# EAGLE design gametroller (EAGLE 9.2.0)
AUTHOR: w. boyett; CONTACT_ADDRESS: github.com/watsonboyett; CONTACT_COMPANY: Make Time Club; CONTACT_PHONE: Licensed under CC-BY-SA; REV: 1B
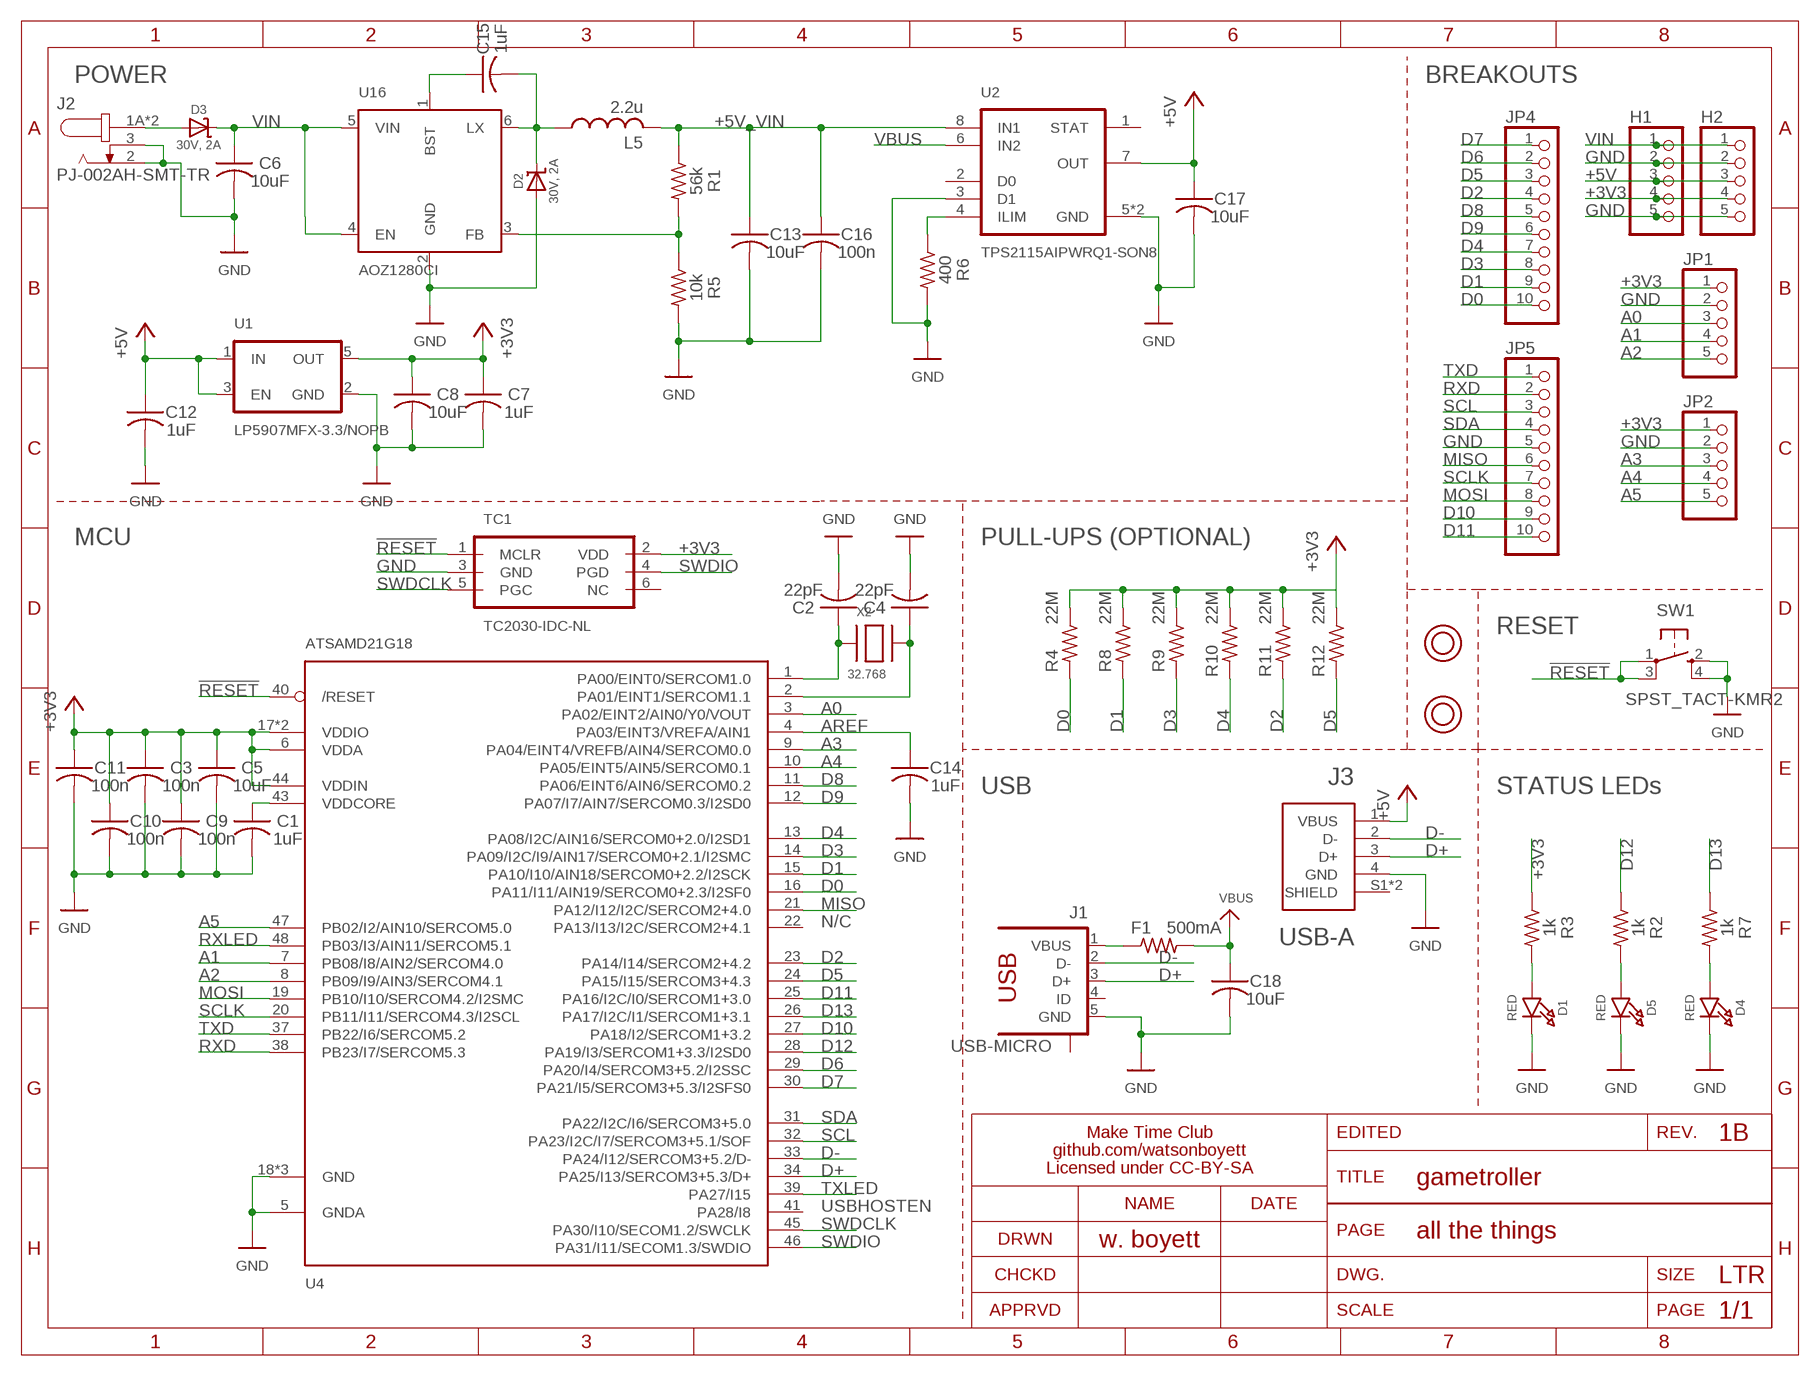
[diagram p0: schematic, sheet 1]
FRAME2 (LETTER_L): SECTION: all the things

## Parts
C1  1uF  C-USC0603  [C0603]
C2  22pF  C-USC0603  [C0603]
C3  100n  C-USC0603  [C0603]
C4  22pF  C-USC0603  [C0603]
C5  10uF  C-USC0805  [C0805]
C6  10uF  C-USC0805  [C0805]
C7  1uF  C-USC0603  [C0603]
C8  10uF  C-USC0805  [C0805]
C9  100n  C-USC0603  [C0603]
C10  100n  C-USC0603  [C0603]
C11  100n  C-USC0603  [C0603]
C12  1uF  C-USC0603  [C0603]
C13  10uF  C-USC0805  [C0805]
C14  1uF  C-USC0603  [C0603]
C15  1uF  C-USC0603  [C0603]
C16  100n  C-USC0603  [C0603]
C17  10uF  C-USC0805  [C0805]
C18  10uF  C-USC0805  [C0805]
D1  RED  LED0805_NOOUTLINE  [CHIPLED_0805_NOOUTLINE]
D2  30V, 2A  DIODE-SCHOTTKYSOD-128  [SOD-128]
D3  30V, 2A  DIODE-SCHOTTKYSOD-128  [SOD-128]
D4  RED  LED0805_NOOUTLINE  [CHIPLED_0805_NOOUTLINE]
D5  RED  LED0805_NOOUTLINE  [CHIPLED_0805_NOOUTLINE]
F1  500mA  R-US_R0603  [R0603]
H1  PINHD-1X5-SMT  [1X05-SMT]
H2  PINHD-1X5-SMT  [1X05-SMT]
J1  USB-MICRO  [USB-10118192-0001LF]
J2  PJ-002AH-SMT-TR  [CUI_PJ-002AH-SMT-TR]
J3  USB-A  [CUI_UJ2-AH-1-SMT]
JP1  PINHD-1X5-SMT  [1X05-SMT]
JP2  PINHD-1X5-SMT  [1X05-SMT]
JP4  PINHD-1X10-SMT  [1X10-SMT]
JP5  PINHD-1X10-SMT  [1X10-SMT]
L5  2.2u  L-USL5050M  [L5050M]
R1  56k  R-US_R0603  [R0603]
R2  1k  R-US_R0603  [R0603]
R3  1k  R-US_R0603  [R0603]
R4  22M  R-US_R0603  [R0603]
R5  10k  R-US_R0603  [R0603]
R6  400  R-US_R0603  [R0603]
R7  1k  R-US_R0603  [R0603]
R8  22M  R-US_R0603  [R0603]
R9  22M  R-US_R0603  [R0603]
R10  22M  R-US_R0603  [R0603]
R11  22M  R-US_R0603  [R0603]
R12  22M  R-US_R0603  [R0603]
SW1  SPST_TACT-KMR2  [KMR2]
TC1  TC2030-IDC-NL  [TC2030-IDC-NL]
U1  LP5907MFX-3.3/NOPB  [SOT95P280X145-5N]
U2  TPS2115AIPWRQ1-SON8  [SON65P300X300X100-9N]
U4  ATSAMD21G18  ATSAMD21J_QFP  [TQFP48_7MM]
U16  AOZ1280CI  [SOT-23-6]
U$7  TERM-7774  [TERM-7774]
U$9  TERM-7774  [TERM-7774]
X2  32.768  XTAL-3.2X1.5  [XTAL3215]

## Nets
!RESET: SW1.1(P) SW1.3(P1) TC1.1(MCLR) U4.40(/RESET)
+3V3: C3.1 C5.1 C7.1 C8.1 C9.1 C10.1 C11.1 H1.4 H2.4 JP1.1 JP2.1 R3.1 R4.1 R8.1 R9.1 R10.1 R11.1 R12.1 TC1.2(VDD) U1.5(OUT) U4.6(VDDA) U4.17(VDDIO) U4.36(VDDIO) U4.44(VDDIN)
+5V: C12.1 C17.1 H1.3 H2.3 J3.1(VBUS) U1.1(IN) U1.3(EN) U2.7(OUT)
+5V_VIN: C13.1 C16.1 L5.2 R1.1 U2.8(IN1)
A0: JP1.3 U4.3(PA02/EINT2/AIN0/Y0/VOUT)
A1: JP1.4 U4.7(PB08/I8/AIN2/SERCOM4.0)
A2: JP1.5 U4.8(PB09/I9/AIN3/SERCOM4.1)
A3: JP2.3 U4.9(PA04/EINT4/VREFB/AIN4/SERCOM0.0)
A4: JP2.4 U4.10(PA05/EINT5/AIN5/SERCOM0.1)
A5: JP2.5 U4.47(PB02/I2/AIN10/SERCOM5.0)
AREF: C14.1 U4.4(PA03/EINT3/VREFA/AIN1)
D0: JP4.10 R4.2 U4.16(PA11/I11/AIN19/SERCOM0+2.3/I2SF0)
D1: JP4.9 R8.2 U4.15(PA10/I10/AIN18/SERCOM0+2.2/I2SCK)
D2: JP4.4 R11.2 U4.23(PA14/I14/SERCOM2+4.2)
D3: JP4.8 R9.2 U4.14(PA09/I2C/I9/AIN17/SERCOM0+2.1/I2SMC)
D4: JP4.7 R10.2 U4.13(PA08/I2C/AIN16/SERCOM0+2.0/I2SD1)
D5: JP4.3 R12.2 U4.24(PA15/I15/SERCOM3+4.3)
D6: JP4.2 U4.29(PA20/I4/SERCOM3+5.2/I2SSC)
D7: JP4.1 U4.30(PA21/I5/SERCOM3+5.3/I2SFS0)
D8: JP4.5 U4.11(PA06/EINT6/AIN6/SERCOM0.2)
D9: JP4.6 U4.12(PA07/I7/AIN7/SERCOM0.3/I2SD0)
D10: JP5.9 U4.27(PA18/I2/SERCOM1+3.2)
D11: JP5.10 U4.25(PA16/I2C/I0/SERCOM1+3.0)
D12: R2.1 U4.28(PA19/I3/SERCOM1+3.3/I2SD0)
D13: R7.1 U4.26(PA17/I2C/I1/SERCOM1+3.1)
D+: J1.3(D+) J3.3(D+) U4.34(PA25/I13/SERCOM3+5.3/D+)
D-: J1.2(D-) J3.2(D-) U4.33(PA24/I12/SERCOM3+5.2/D-)
GND: C1.2 C2.2 C3.2 C4.2 C5.2 C6.2 C7.2 C8.2 C9.2 C10.2 C11.2 C12.2 C13.2 C14.2 C16.2 C17.2 C18.2 D1.C D2.A D4.C D5.C H1.2 H1.5 H2.2 H2.5 J1.5(GND) J2.2 J2.3 J3.4(GND) JP1.2 JP2.2 JP5.5 R5.2 R6.2 SW1.2(S) SW1.4(S1) TC1.3(GND) U1.2(GND) U2.3(D1) U2.5(GND) U2.9(GND) U4.5(GNDA) U4.18(GND) U4.35(GND) U4.42(GND) U16.2(GND)
LX: C15.2 D2.C L5.1 U16.6(LX)
MISO: JP5.6 U4.21(PA12/I12/I2C/SERCOM2+4.0)
MOSI: JP5.8 U4.19(PB10/I10/SERCOM4.2/I2SMC)
N$1: D5.A R2.2
N$2: D4.A R7.2
N$3: D1.A R3.2
N$4: F1.1 J1.1(VBUS)
N$5: C2.1 U4.1(PA00/EINT0/SERCOM1.0) X2.P$1
N$7: C4.1 U4.2(PA01/EINT1/SERCOM1.1) X2.P$2
N$8: C15.1 U16.1(BST)
N$9: R6.1 U2.4(ILIM)
N$11: R1.2 R5.1 U16.3(FB)
RXD: JP5.2 U4.38(PB23/I7/SERCOM5.3)
RXLED: U4.48(PB03/I3/AIN11/SERCOM5.1)
SCL: JP5.3 U4.32(PA23/I2C/I7/SERCOM3+5.1/SOF)
SCLK: JP5.7 U4.20(PB11/I11/SERCOM4.3/I2SCL)
SDA: JP5.4 U4.31(PA22/I2C/I6/SERCOM3+5.0)
SWDCLK: TC1.5(PGC) U4.45(PA30/I10/SECOM1.2/SWCLK)
SWDIO: TC1.4(PGD) U4.46(PA31/I11/SECOM1.3/SWDIO)
TXD: JP5.1 U4.37(PB22/I6/SERCOM5.2)
TXLED: U4.39(PA27/I15)
VBUS: C18.1 F1.2 U2.6(IN2)
VDDCORE: C1.1 U4.43(VDDCORE)
VIN: C6.1 D3.C H1.1 H2.1 U16.4(EN) U16.5(VIN)
VIN_PRE: D3.A J2.1A J2.1B
Unconnected: J1.4(ID) J1.M1(S) J1.M2(S) J1.S1(S) J1.S2(S) J1.S3(S) J1.S4(S) J3.S1(SHIELD) J3.S2(SHIELD) TC1.6(NC) U2.1(STAT) U2.2(D0) U4.22(PA13/I13/I2C/SERCOM2+4.1) U4.41(PA28/I8)

## Notes on the sheet
- POWER | BREAKOUTS
- MCU | PULL-UPS (OPTIONAL)
- RESET
- USB | STATUS LEDs
- N/C
- USBHOSTEN

## Library data of the parts
C1 C7 C12 C14 C15 = gametroller:C-US: CAPACITOR, American symbol; MFG: AVX Corporation; MPN: 0603ZC105KAT2A; PN-DK: 478-7940-1-ND
C2 C4 = gametroller:C-US: CAPACITOR, American symbol; MFG: KEMET; MPN: C0603C220K4GACTU; PN-DK: 399-9031-1-ND
C3 C9-C11 C16 = gametroller:C-US: CAPACITOR, American symbol; MFG: KEMET; MPN: C0603X104K5RAC7867; PN-DK: 399-7969-1-ND
C5 C6 C8 C13 C17 C18 = gametroller:C-US: CAPACITOR, American symbol; MFG: TDK Corporation; MPN: C2012JB1E106K085AC; PN-DK: 445-11462-1-ND
D1 D4 D5 = gametroller:LED: LED 0603 - 0603 Surface Mount Package 2mA: Green LED - Low Power (3.9mcd, 2ma, 1.7Vf) - Digikey: 475-2709-2-ND Orange LED - Low Power (9.8mcd, 2ma, 1.8Vf) - Digikey: 475-1194-2-ND Red LED - Low Power (5mcd, 2ma, 1.8Vf) - Digikey: 475-1195-2-ND Yellow LED - Low Power (7mcd, 2ma, 1.8Vf) - Digikey: 475-1196-2-ND 5mA: Blue LED - Low Power (17mcd, 5ma, 2.9Vf) - Digikey: LNJ937W8CRACT-ND 0805 - 0805 Surface Mount Package 2mA: Red LED (8.8mcd, 2mA, 1.8Vf, Clear) - Low Power [Digikey: 475-2510-1-ND] Green LED (5mcd, 2mA, 1.8Vf, Clear) - Low Power [Digikey: 475-2730-1-ND] Yellow LED (11.3mcd, 2mA, 1.8Vf, Clear) - Low Power [Digikey: 475-2555-1-ND] 20mA: Red LED (104mcd, 20mA, Diffused) - LS R976 [Digikey: 475-1278-6-ND] Red LED (12mcd, 20mA, 2.0Vf, Clear) - APT2012EC [Digikey: 754-1128-1-ND] Green LED (15mcd, 20mA, 2.2Vf, Clear) - APT2012GC [Digikey: 754-1131-1-ND] Orange LED (160mcd, 20mA, 2.1Vf, Clear) - APT2012SECK [Digikey: 754-1130-1-ND] 1206 - 1206 Surface Mount Package Green LED (26mcd, 20mA, Diffused) - LG N971 [Digikey: 475-1407-6-ND] Red LED (15mcd, 20mA, Diffused) - LH N974 [Digikey: 475-1416-6-ND] Cree - Cree High-Power Surface Mount LEDs XPEBWT-L1-0000-00D50 - White 111lm 350mA 2.9Vf 6200K 110° XTEAWT-00-0000-00000LEE3 - White 114lm 350mA 2.85Vf 5000K 115° Everlight - Everlight 45-21 Series Surface Mount LEDs 45-21/QK2C-B2832AC2CB2/2T - Warm White 2000mcd 20mA 3.25Vf 3050K 120° 45-21/LK2C-B38452C4CB2/2T - Nuetral White 2000mcd 20mA 3.25Vf 4150K 120° 45-21/LK2C-B50634C6CB2/2T - Cold White 2200mcd 20mA 3.25Vf 5650K 120° PLCC2 Reverse Mount LS T77K-J1L2-1-0-2-R18-Z - Red 11.25mcd 2mA 1.8Vf 630nm 120° LO T77K-L1M2-24-Z - Orange 19.6mcd 2mA 1.8Vf 606nm 120° LY T77K-K2M1-26-Z - Yellow 15.7mcd 2mA 1.8Vf 587nm 120°; MFG: Lite-On Inc.; MPN: LTST-C170GKT; PN-DK: 160-1179-1-ND
D2 D3 = gametroller:DIODE-SCHOTTKY; MFG: Toshiba Semiconductor and Storage; MPN: CMS06(TE12L,Q,M); PN-DK: CMS06QMCT-ND
F1 = gametroller:R-US_: RESISTOR, American symbol; MFG: Bourns Inc.; MPN: MF-FSMF050X-2; PN-DK: MF-FSMF050X-2CT-ND
H1 H2 JP1 JP2 = gametroller:PINHD-1X5: PIN HEADER
J1 = gametroller:USB-MICRO: CONN USB MICRO B RECPT SMT R/A; MFG: Amphenol; MPN: 10118192-0001LF; PN-DK: 609-4613-1-ND
J2 = gametroller:PJ-002AH-SMT-TR: Power Barrel Connector Jack 2.00mm ID (0.079"), 5.50mm OD (0.217"); MFG: CUI; MPN: PJ-002AH-SMT-TR; PN-DK: CP-002AHPJCT-ND
J3 = gametroller:USB-A: USB - A USB 2.0 Receptacle Connector; MFG: CUI; MPN: UJ2-AH-1-SMT-TR; PN-DK: 102-4133-1-ND
JP4 JP5 = gametroller:PINHD-1X10: PIN HEADER
L5 = gametroller:L-US: INDUCTOR, American symbol; MFG: Laird-Signal Integrity Products; MPN: TYS50402R2N-10; PN-DK: 240-2714-1-ND
R1 = gametroller:R-US_: RESISTOR, American symbol; MFG: Panasonic Electronic Components; MPN: ERJ-3EKF5602V; PN-DK: P56.0KHCT-ND
R2 R3 R7 = gametroller:R-US_: RESISTOR, American symbol; MFG: Panasonic Electronic Components; MPN: ERJ-3EKF1001V; PN-DK: P1.00KHCT-ND
R4 R8-R12 = gametroller:R-US_: RESISTOR, American symbol; MFG: Panasonic Electronic Components; MPN: ERJ-3GEYK226V; PN-DK: P22MGCT-ND
R5 = gametroller:R-US_: RESISTOR, American symbol; MFG: Panasonic Electronic Components; MPN: ERJ-3GEYJ103V; PN-DK: P10KGCT-ND
R6 = gametroller:R-US_: RESISTOR, American symbol; MFG: Panasonic Electronic Components; MPN: ERJ-3EKF4020V; PN-DK: P402HCT-ND
SW1 = gametroller:SPST_TACT: SMT 6mm switch, EVQQ2 series http://www.ladyada.net/library/eagle; MFG: C&K; MPN: KMR211GLFS; PN-DK: 401-1426-1-ND
TC1 = gametroller:TC2030-IDC: Tag-Connect In Circuit Programming & Debug Cable 6 Pin http://www.tag-connect.com; MFG: Tag-Connect; MPN: TC2030-IDC
U1 = gametroller:LP5907MFX-3.3/NOPB: IC REG LINEAR 3.3V 250MA SOT23; MFG: Texas Instruments; MPN: LP5907MFX-3.3/NOPB; PN-DK: 296-38557-1-ND
U2 = gametroller:TPS2115AIPWRQ1: AUTO-SWITCHING POWER MULTIPLEXER; MFG: Texas Instruments; MPN: TPS2115ADRBR; PN-DK: 296-23394-1-ND
U4 = gametroller:ATSAMD21J: ARM® Cortex®-M0+ SAM D21G Microcontroller IC 32-Bit 48MHz 256KB (256K x 8) FLASH; MFG: Microchip Technology; MPN: ATSAMD21G18A; PN-DK: ATSAMD21G18A-AFTCT-ND
U16 = gametroller:AOZ1280CI: IC REG BUCK ADJ 1.2A SOT23-6; MFG: Alpha & Omega Semiconductor Inc.; MPN: AOZ1280CI; PN-DK: 785-1277-1-ND
U$7 U$9 = gametroller:TERM: TERM SCREW 4-40 4 PIN PCB RA; MFG: Keystone Electronics; MPN: 7774; PN-DK: 36-7774-ND
X2 = gametroller:XTAL: Low cost SMT crystals, no capacitors included http://www.ladyada.net/library/eagle; MFG: ECS Inc.; MPN: ECS-.327-12.5-34B-TR; PN-DK: XC1617CT-ND

## Board
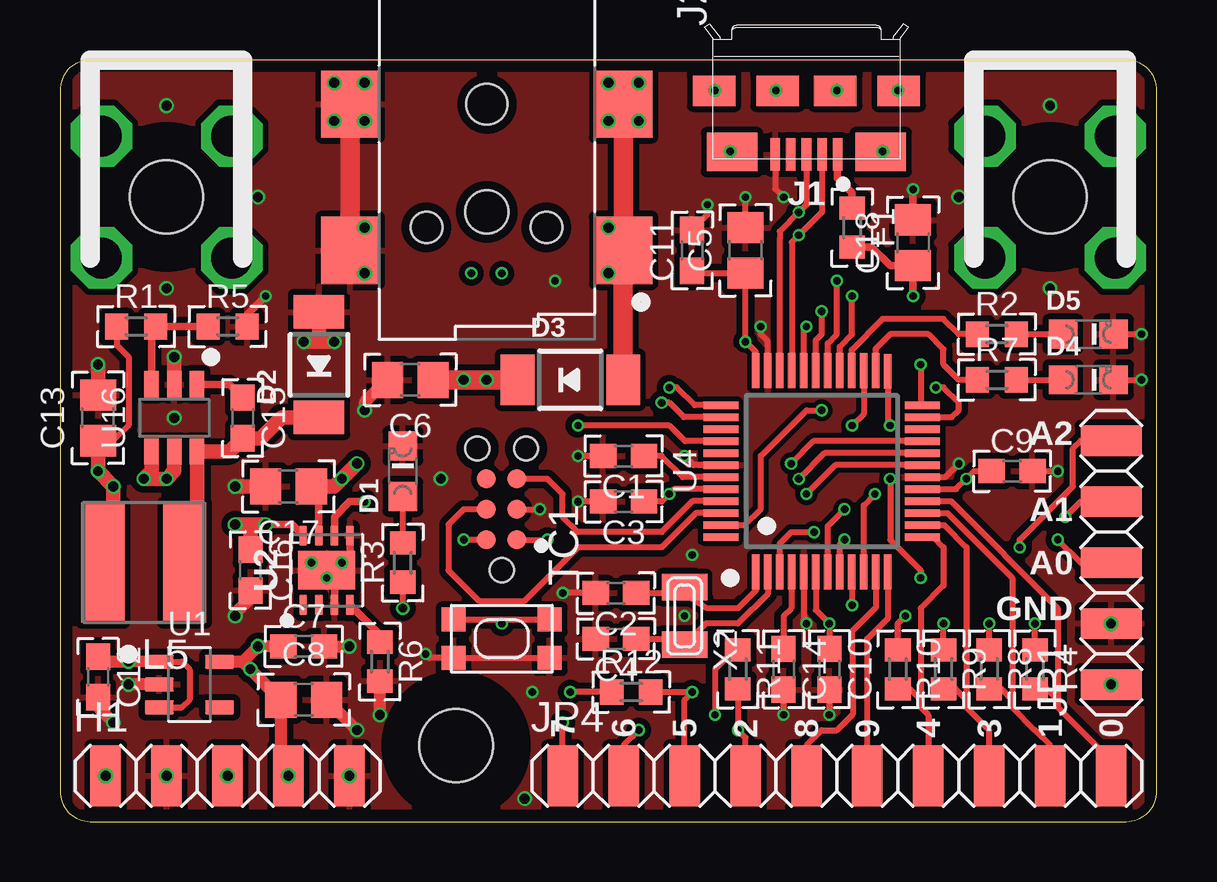
[diagram p1: board, top side]
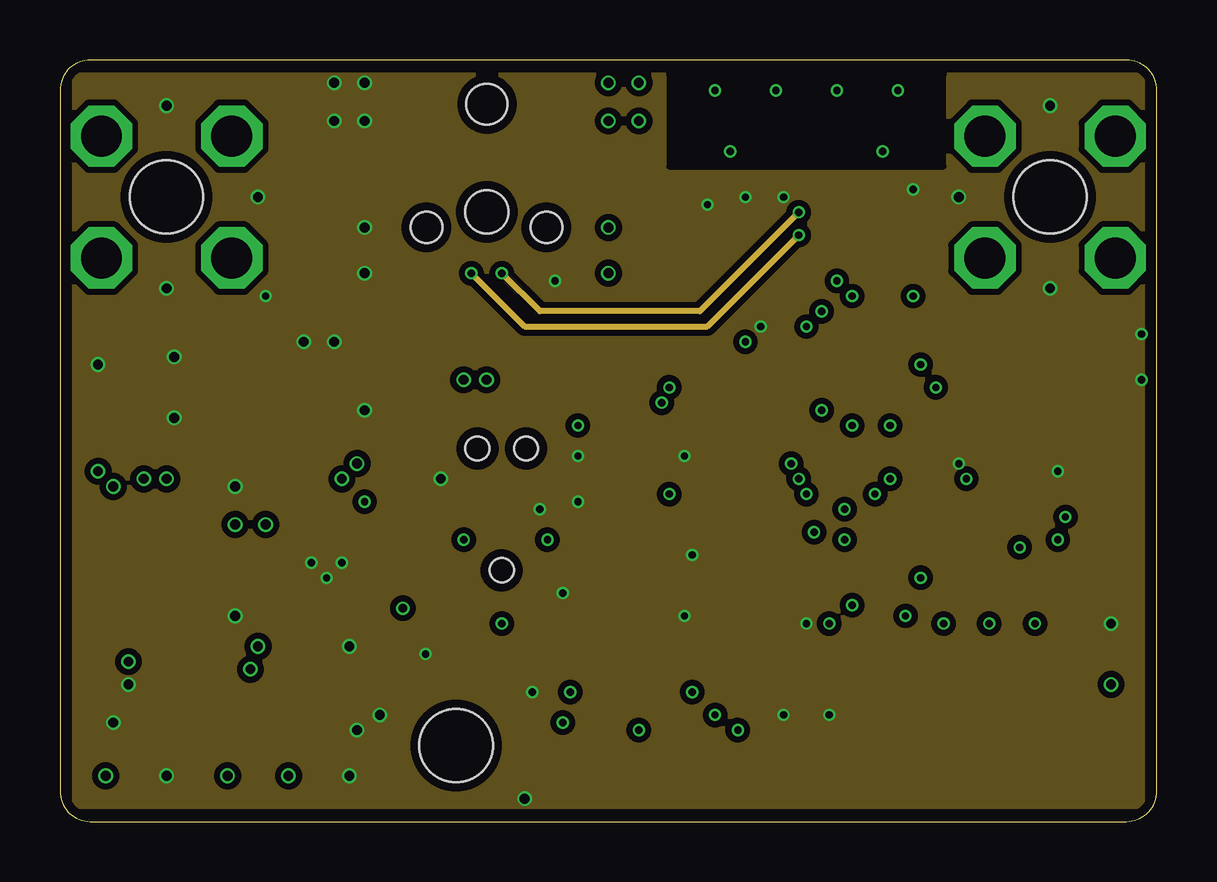
[diagram p2: board, inner layer Route2]
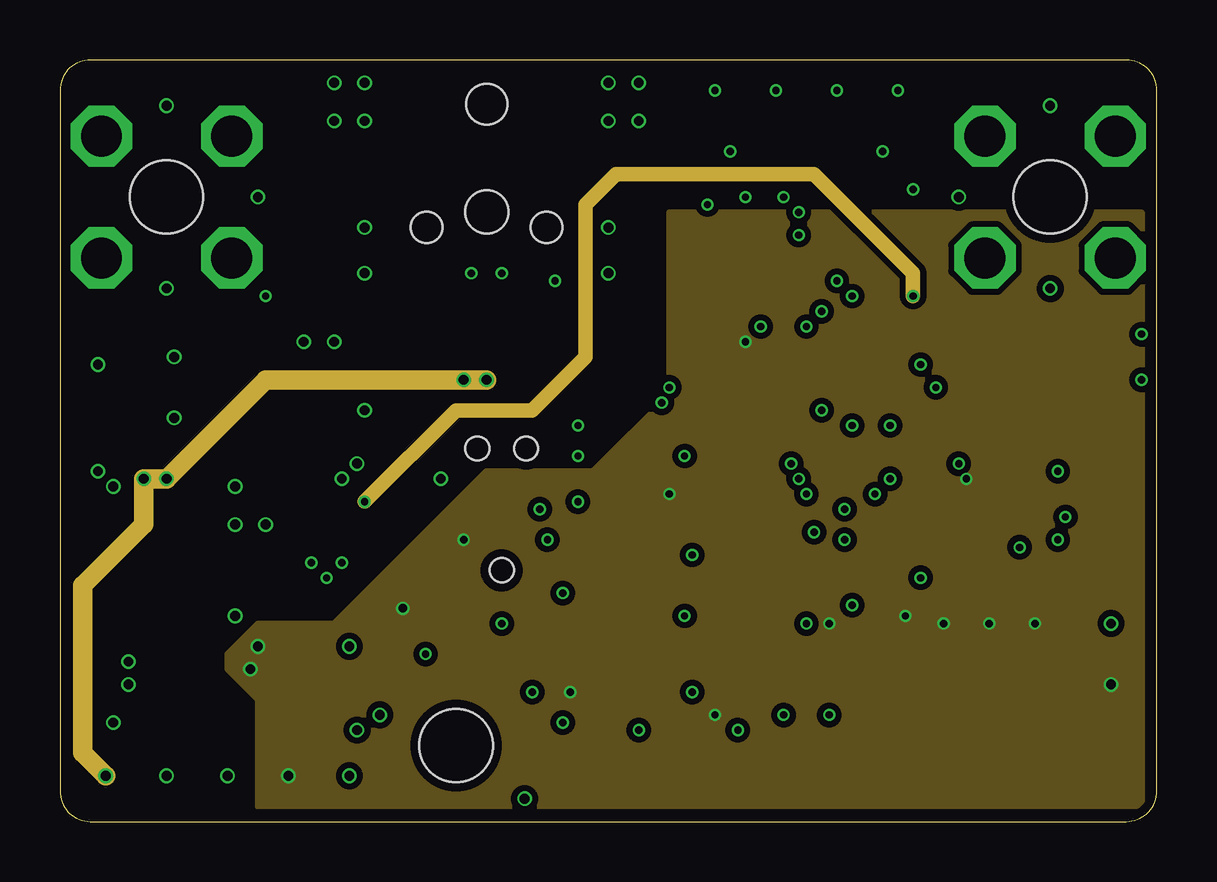
[diagram p3: board, inner layer Route15]
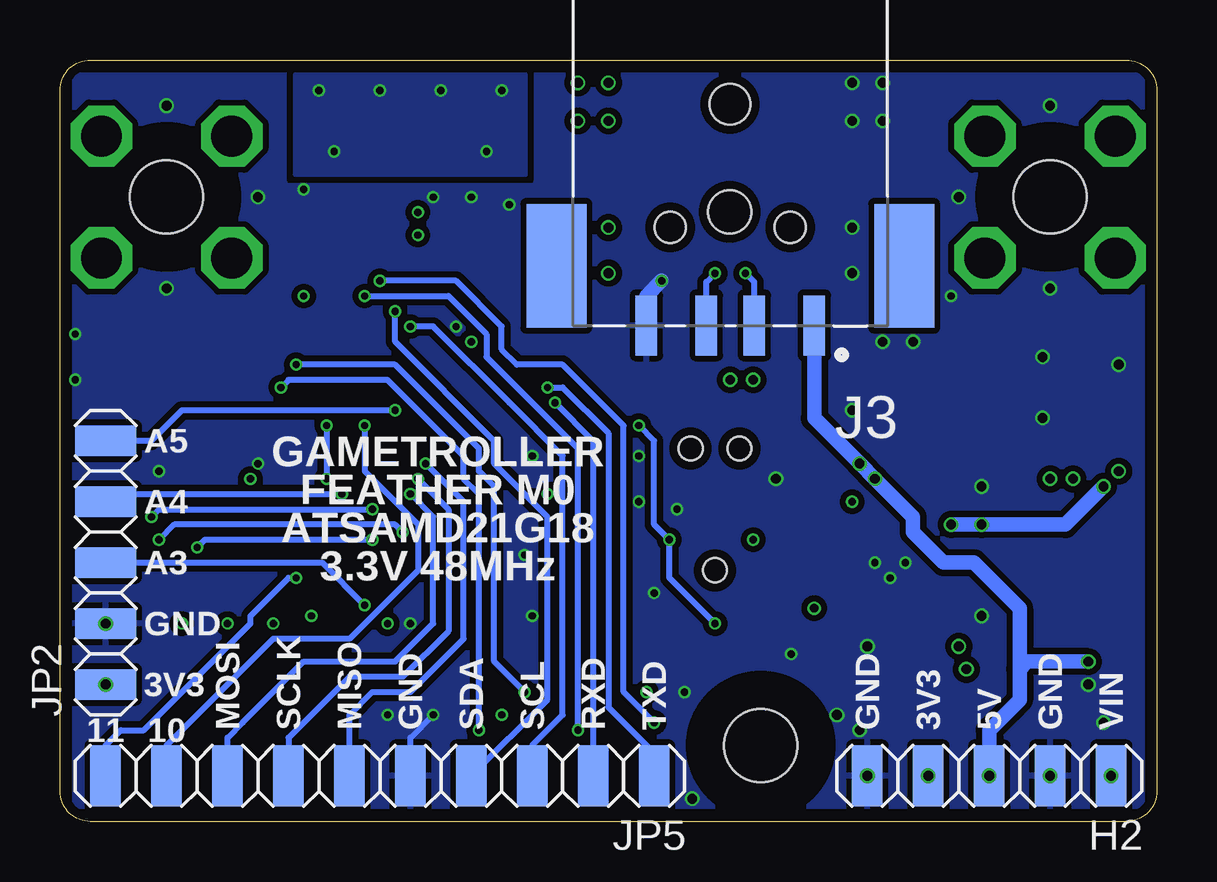
[diagram p4: board, bottom side, seen from below]

Size 45.72 x 31.75 mm. Coordinates in mm from the lower left corner, seen from the top.
Outline: 44.45,31.75 1.27,31.75 arc90 0,30.48 0,1.27 arc90 1.27,0 44.45,0 arc90 45.72,1.27 45.72,30.48 arc90 44.45,31.75
Copper layers (1*2*15*16): Top 0.035559375mm / dielectric 0.17018125mm / Route2 0.01778125mm / dielectric 47mil / Route15 0.01778125mm / dielectric 0.17018125mm / Bottom 0.035559375mm
Design rules "OshPark-4layer *": minimum track width 10mil, minimum drill 12mil, track to track 5mil, track to pad 5mil, pad to pad 5mil, via to via 5mil, smd to smd 5mil, copper to edge 15mil, drill to drill 6mil, minimum pad ring 4mil, minimum via ring 4mil, stop-mask expansion 2.5mil, vias tented up to drill 1mm, thermal gap 10mil

### Footprints (pad centres in the part's own frame; a part is rotated, then mirrored left to right if it is on the bottom)
C0603 = smd 1.1 x 1: 1 -0.85,0; 2 0.85,0
C0805 = smd 1.3 x 1.5: 1 -0.95,0; 2 0.95,0
CHIPLED_0805_NOOUTLINE = smd 1.2 x 1.2: A 0,-1.05; C 0,1.05
SOD-128 = smd 1.4 x 2.1: A 2.2,0; C -2.2,0
R0603 = smd 0.965 x 1.067: 1 -0.813,0; 2 0.813,0
1X05-SMT = smd 1.27 x 2.54: 1 -5.08,0; 2 -2.54,0; 3 0,0; 4 2.54,0; 5 5.08,0
USB-10118192-0001LF = smd 0.4 x 1.35: 1 -1.3,4.1; 2 -0.65,4.1; 3 0,4.1; 4 0.65,4.1; 5 1.3,4.1 | smd 1.778 x 1.27: M1 -1.2,1.45; M2 1.2,1.45; S1 -3.85,1.45; S2 3.85,1.45 | smd 2.1 x 1.6: S3 -3.1,4; S4 3.1,4
CUI_PJ-002AH-SMT-TR = smd 2.8 x 2.4: 1A 3.81,5.715; 1B -2.29,5.715; 2 -2.29,-5.685; 3 3.81,-5.685 | hole 1.7: -2.29,0.015 | hole 1.8: 2.21,0.015
CUI_UJ2-AH-1-SMT = smd 0.9 x 2.5: 1 -3.5,4.08; 2 -1,4.08; 3 1,4.08; 4 3.5,4.08 | smd 2.5 x 5.15: S1 -7.25,1.6; S2 7.25,1.6 | hole 1.3: -2.5,0; 2.5,0
1X10-SMT = smd 1.27 x 2.54: 1 -11.43,0; 2 -8.89,0; 3 -6.35,0; 4 -3.81,0; 5 -1.27,0; 6 1.27,0; 7 3.81,0; 8 6.35,0; 9 8.89,0; 10 11.43,0
L5050M = smd 1.8 x 5: 1 -1.7,0; 2 1.7,0
KMR2 = smd 1 x 1: 1 2,0.8; 2 2,-0.8; 3 -2,0.8; 4 -2,-0.8
TC2030-IDC-NL = smd 0.787 x 0.787: 1 -1.27,-0.635; 2 -1.27,0.635; 3 0,-0.635; 4 0,0.635; 5 1.27,-0.635; 6 1.27,0.635 | hole 0.991: -2.54,0; 2.54,1.016; 2.54,-1.016
SOT95P280X145-5N = smd 1.21 x 0.59: 1 -1.255,0.95; 2 -1.255,0; 3 -1.255,-0.95; 4 1.255,-0.95; 5 1.255,0.95
SON65P300X300X100-9N = smd 0.84 x 0.32: 1 -1.44,0.975; 2 -1.44,0.325; 3 -1.44,-0.325; 4 -1.44,-0.975; 5 1.44,-0.975; 6 1.44,-0.325; 7 1.44,0.325; 8 1.44,0.975 | smd 1.621 x 2.359: 9 0,0
TQFP48_7MM = smd 1.45 x 0.3: 1 -4.2,2.75; 2 -4.2,2.25; 3 -4.2,1.75; 4 -4.2,1.25; 5 -4.2,0.75; 6 -4.2,0.25; 7 -4.2,-0.25; 8 -4.2,-0.75; 9 -4.2,-1.25; 10 -4.2,-1.75; 11 -4.2,-2.25; 12 -4.2,-2.75; 25 4.17,-2.75; 26 4.2,-2.25; 27 4.2,-1.75; 28 4.2,-1.25; 29 4.2,-0.75; 30 4.2,-0.25; 31 4.2,0.25; 32 4.2,0.75; 33 4.2,1.25; 34 4.2,1.75; 35 4.2,2.25; 36 4.2,2.75 | smd 0.3 x 1.45: 13 -2.75,-4.2; 14 -2.25,-4.2; 15 -1.75,-4.2; 16 -1.25,-4.2; 17 -0.75,-4.2; 18 -0.25,-4.2; 19 0.25,-4.2; 20 0.75,-4.2; 21 1.25,-4.2; 22 1.75,-4.2; 23 2.25,-4.2; 24 2.75,-4.2; 37 2.75,4.2; 38 2.25,4.2; 39 1.75,4.2; 40 1.25,4.2; 41 0.75,4.2; 42 0.25,4.2; 43 -0.25,4.2; 44 -0.75,4.2; 45 -1.25,4.2; 46 -1.75,4.2; 47 -2.25,4.2; 48 -2.75,4.2
SOT-23-6 = smd 1.1 x 0.6: 1 -1.4,0.95; 2 -1.4,0; 3 -1.4,-0.95; 4 1.4,-0.95; 5 1.4,0; 6 1.4,0.95
TERM-7774 = drill 1.702 octagon: P$1 -2.718,2.54; P$2 2.718,2.54; P$3 2.718,-2.54; P$4 -2.718,-2.54
HOLE_4-40 = hole 3.048: 0,0
XTAL3215 = smd 1.1 x 1.9: P$1 1.2,0; P$2 -1.2,0

### Placement (x,y rotation side)
C1  23.5,15.24 180 top
C2  23.18,9.53 180 top
C3  23.5,13.34 180 top
C4  23.18,7.62 180 top
C5  28.57,23.81 90 top
C6  14.61,18.41 180 top
C7  10.16,7.3 0 top
C8  10.16,5.08 0 top
C9  39.69,14.61 0 top
C10  32.07,6.35 270 top
C11  26.35,23.81 90 top
C12  1.59,6.03 270 top
C13  1.59,16.83 90 top
C14  30.16,6.35 270 top
C15  7.62,16.83 270 top
C16  7.94,10.48 270 top
C17  9.53,13.97 180 top
C18  35.56,24.13 90 top
D1  14.29,14.61 0 top
D2  10.79,19.05 90 top
D3  21.27,18.41 0 top
D4  42.86,18.41 270 top
D5  42.86,20.32 270 top
F1  33.02,24.77 270 top
H1  6.99,1.91 0 top
H2  6.99,1.91 180 bottom
J1  31.11,31.91 180 top
J2  17.78,27.62 270 top
J3  17.78,24.77 180 bottom
JP1  43.81,10.79 90 top
JP2  43.81,10.79 90 bottom
JP4  32.38,1.91 0 top
JP5  32.38,1.91 180 bottom
L5  3.49,10.79 180 top
R1  3.17,20.64 0 top
R2  39.05,20.32 0 top
R3  14.29,10.79 90 top
R4  40.64,6.35 270 top
R5  6.99,20.64 0 top
R6  13.34,6.67 270 top
R7  39.05,18.41 0 top
R8  38.73,6.35 270 top
R9  36.83,6.35 270 top
R10  34.92,6.35 270 top
R11  28.26,6.35 270 top
R12  23.81,5.4 0 top
SW1  18.41,7.62 0 top
TC1  18.41,13.02 90 top
U1  5.4,5.71 0 top
U2  11.11,10.48 90 top
U4  31.75,14.61 90 top
U16  4.76,16.83 270 top
U$7  41.27,26.04 0 top
U$9  4.45,26.04 0 top
U$12  [HOLE_4-40]  4.45,26.04 0 top
U$13  [HOLE_4-40]  41.27,26.04 0 top
U$15  [HOLE_4-40]  16.51,3.17 0 top
X2  26.04,8.57 90 top

### Tracks (layer width: path | path; a pad name or v marks a point on that pad's centre or on a via)
!RESET  (via drill 0.3)
  Top 0.254: SW1.3 18.41,8.42 | 18.41,8.42 SW1.1 18.58,8.42 | TC1.1 v20.32,11.75 | v21.59,16.51 25.4,16.51 26.05,15.86 U4.40 | v18.41,8.26 18.41,8.42
  Bottom 0.254: v21.59,16.51 20.95,15.88 20.95,12.38 v20.32,11.75 20.32,10.16 v18.41,8.26
+3V3  (via drill 0.3, 0.35, 0.41)
  Top 0.254: U4.44 25.6,13.86 v25.4,13.65 25.08,13.34 C3.1 | C11.1 26.45,22.86 C5.1 v28.57,20 29,19.58 U4.36 | U4.17 37.35,13.86 v37.78,14.29 38.1,14.61 C9.1 | U4.6 31.5,8.82 v32.07,8.26 C10.1 | TC1.2 v16.83,11.75 | R3.1 v14.29,8.89 | R8.1 v38.73,8.26 | R4.1 v40.64,8.26 | R10.1 34.92,8.26 v35.24,8.57 | R9.1 v36.83,8.26 | R12.1 v21.27,5.4 | R11.1 28.12,7.16 27.3,6.35 v27.3,4.45
  Top 0.508: 7.62,6.67 U1.5 | C7.1 v8.26,7.3 7.62,6.67 | 7.62,6.67 v7.94,6.35 C8.1 9.21,2.22 H1.4
  other vias: 9.53,1.91 43.81,5.71
  pour Route15 (isolate 0.254): 8.26,0.64 8.26,5.08 7.62,5.71 6.99,6.35 6.99,6.99 8.26,8.26 11.43,8.26 16.51,13.34 17.78,14.61 22.23,14.61 25.4,17.78 25.4,25.4 45.09,25.4 45.09,0.64
+5V  (via drill 0.41)
  Top 0.254: U1.3 5.08,4.76 5.4,5.08 5.4,6.35 5.08,6.67 U1.1
  Top 0.305: U2.7 10.79,13.66 C17.1
  Top 0.508: U1.1 v2.86,6.67 v2.85,6.67 1.8,6.67 C12.1
  Top 0.61: C17.1 11.43,13.97 v12.38,14.92
  Bottom 0.61: J3.1 14.28,16.82 v12.38,14.92 v11.75,14.29 10.16,12.7 10.16,12.06 8.89,10.79 7.62,10.79 5.71,8.89 5.71,6.35 | 5.71,6.35 5.71,5.08 6.99,3.81 H1.3 | v2.86,6.67 5.4,6.67 5.71,6.35
  other vias: 6.99,1.91
+5V_VIN  (via drill 0.41)
  Top 0.254: C13.1 2.23,15.88 2.86,16.51 2.86,19.37 2.36,19.86 R1.1
  Top 0.305: v8.57,12.38 9.67,12.38 U2.8
  Top 0.61: C13.1 v1.59,14.61 v2.22,13.97 2.22,11.43 1.79,11 L5.2 | v7.3,12.38 7.94,12.38 | C16.1 7.94,12.38 | v8.57,12.38 7.94,12.38
  Bottom 0.61: v2.22,13.97 3.81,12.38 v7.3,12.38 v8.57,12.38
A0  (via drill 0.3)
  Top 0.254: v41.59,11.75 42.55,10.79 JP1.3 | U4.3 30,11.59 30.48,12.06 v31.43,12.06
  Bottom 0.254: v31.43,12.06 31.75,12.38 40.96,12.38 v41.59,11.75
A1  (via drill 0.3)
  Top 0.254: v41.91,12.7 42.55,13.34 JP1.4 | U4.7 32,12.31 v32.7,13.02
  Bottom 0.254: v32.7,13.02 41.59,13.02 v41.91,12.7
A2  (via drill 0.3)
  Top 0.254: U4.8 32.5,11.54 v32.7,11.75 | v40.01,11.43 40.01,11.75 42.23,13.97 42.23,15.56 42.55,15.88 JP1.5
  Bottom 0.254: v32.7,11.75 39.69,11.75 v40.01,11.43
A3  (via drill 0.3)
  Top 0.254: v33.02,9.02 33.02,10.38 U4.9
  Bottom 0.254: v33.02,9.02 34.8,10.79 JP2.3
A4  (via drill 0.3)
  Top 0.254: U4.10 33.5,13.18 v33.97,13.65
  Bottom 0.254: v33.97,13.65 43.5,13.65 JP2.4
A5  (via drill 0.3)
  Top 0.254: U4.47 28.55,12.36 29.21,13.02 29.21,15.24 31.11,17.14 v31.75,17.14
  Bottom 0.254: JP2.5 41.91,15.88 40.64,17.14 v31.75,17.14
AREF
  Top 0.254: U4.4 30.48,10.38 30.48,8.89 30.16,8.57 C14.1
CO
  cutout Route2: 25.4,31.11 25.4,27.3 36.83,27.3 36.83,31.11
D0
  Top 0.254: JP4.10 43.81,2.54 41.59,4.76 41.59,5.08 | 41.59,5.08 41.59,7.94 41.59,8.89 37.13,13.36 U4.16 | R4.2 41.13,5.54 41.59,5.08
D1
  Top 0.254: U4.15 36.99,12.86 39.69,10.16 39.69,5.08 | 39.69,5.08 39.69,4.76 40.64,3.81 41.27,3.17 JP4.9 | R8.2 39.23,5.54 39.69,5.08
D2  (via drill 0.3)
  Top 0.254: JP4.4 28.57,3.49 28.42,3.65 | 28.42,3.65 v28.26,3.81 | U4.23 37.17,16.86 37.47,17.14 37.47,17.46 36.83,18.1 v36.51,18.1 | R11.2 v28.26,3.81 | v28.26,3.81 28.42,3.65
  Bottom 0.254: v28.26,3.81 28.26,13.65 28.89,14.29 28.89,15.24 32.07,18.41 36.2,18.41 v36.51,18.1
D3
  Top 0.254: JP4.8 38.73,3.81 37.78,4.76 37.78,5.08 | U4.14 36.86,12.36 37.78,11.43 37.78,5.08 | R9.2 37.33,5.54 37.78,5.08
D4
  Top 0.254: 35.88,5.08 35.88,8.89 36.83,9.84 36.83,11.43 36.41,11.86 U4.13 | 35.88,5.08 35.88,4.76 36.2,4.45 JP4.7 | R10.2 35.42,5.54 35.88,5.08
D5  (via drill 0.3)
  Top 0.254: JP4.3 26.04,5.08 v26.35,5.4 R12.2 | v35.88,19.05 35.88,17.43 U4.24
  Bottom 0.254: v26.35,5.4 27.62,6.67 27.62,13.97 28.26,14.61 28.26,15.56 31.75,19.05 v35.88,19.05
D6  (via drill 0.3)
  Top 0.254: JP4.2 23.5,3.17 v24.13,3.81 | U4.29 32.5,19.8 33.02,20.32 v33.02,21.91
  Bottom 0.254: v33.02,21.91 29.53,21.91 27.94,20.32 27.94,19.37 24.13,15.56 v24.13,3.81
D7  (via drill 0.3)
  Top 0.254: JP4.1 20.95,3.17 v20.95,4.13 | U4.30 32,19.93 32.38,20.32 v32.38,22.54
  Bottom 0.254: v20.95,4.13 22.23,5.4 22.23,16.51 24.77,19.05 26.67,19.05 27.3,19.68 27.3,20.64 29.21,22.54 v32.38,22.54
D8
  Top 0.254: U4.11 34,8.92 33.02,7.94 33.05,4.47 32.38,3.81 31.75,3.81 31.11,3.17 JP4.5
D9
  Top 0.254: U4.12 34.5,8.46 33.66,7.62 JP4.6
D10  (via drill 0.3)
  Top 0.254: U4.27 33.5,16.99 v33.02,16.51
  Bottom 0.254: v33.02,16.51 33.02,14.61 30.8,12.38 30.8,10.48 33.66,7.62 36.83,7.62 41.27,3.17 JP5.9
D11  (via drill 0.3)
  Top 0.254: U4.25 34.5,16.62 v34.61,16.51 | v34.61,14.29 34.61,11.75 35.88,10.48 v35.88,10.16
  Bottom 0.254: JP5.10 43.81,3.17 43.18,3.81 42.23,3.81 37.78,8.26 37.78,8.57 36.2,10.16 v35.88,10.16 | v34.61,16.51 v34.61,14.29
D12
  Top 0.254: U4.28 33,19.66 34.29,20.95 36.83,20.95 37.47,20.32 R2.1
D13
  Top 0.254: U4.26 34,19.71 34.61,20.32 36.2,20.32 36.83,19.68 36.83,19.05 37.47,18.41 R7.1
D+  (via drill 0.3)
  Top 0.254: U4.34 30,24.29 30,24.6 v30.8,25.4 31.11,25.72 J1.3
  Route2 0.254: v18.41,22.86 20,21.27 26.67,21.27 v30.8,25.4
  Bottom 0.254: J3.3 18.78,22.5 v18.41,22.86
D-  (via drill 0.3)
  Top 0.254: U4.33 30.5,24.15 v30.8,24.45 31.77,25.41 J1.2
  Route2 0.254: v17.14,22.86 19.37,20.64 26.99,20.64 v30.8,24.45
  Bottom 0.254: J3.2 16.78,22.5 v17.14,22.86
GND  (via drill 0.3, 0.41)
  Top 0.254: C14.2 v30.16,4.45 | C10.2 v32.07,4.45 | C2.2 v20.95,9.53 | C3.2 v21.59,13.34 | C1.2 v21.59,15.24 | C5.2 v28.57,26.04 | v26.99,25.72 26.99,25.3 C11.2 | D5.C v45.09,20.32 | D4.C v45.09,18.41 | SW1.2 SW1.4 15.4,6.82 v15.24,6.99 | C9.2 v41.59,14.61 | J1.5 29.82,26.38 v30.16,26.04 | U4.5 31,8.37 v31.11,8.26 | U4.18 36.9,14.36 v37.47,14.92 | U4.35 29.5,20.03 29.21,20.32 v29.21,20.64 | U4.42 26.42,14.86 v26.04,15.24 | TC1.3 v20,13.02 | J2.2 12.1,29.82 v12.7,29.21 | U2.9 v11.11,10.16
  Top 0.305: R5.2 7.8,21.13 v8.57,21.91 | U2.3 11.44,9.84 v11.11,10.16 | U2.5 12.09,11.13 v11.75,10.79 | v35.56,26.35 35.56,26.04 C18.2
  Top 0.508: C7.2 v12.06,7.3 | v12.38,3.81 C8.2 | U1.2 v2.86,5.71 | C12.2 1.59,4.76 v2.22,4.13 | v7.3,8.57 7.3,8.68 7.94,9.31 C16.2 | v13.34,4.45 R6.2 | C6.2 12.7,17.46 v12.7,17.14
  Top 0.61: U16.2 v4.76,19.37 | C13.2 v1.59,19.05 | v10.16,20 10.79,20 | 10.79,20 v11.43,20 | D2.A 10.79,20 | C17.2 v7.3,13.97
  Top 0.813: J2.2 J2.3
  Bottom 0.254: JP5.5 31.11,3.49 v30.16,4.45
  Bottom 0.61: J3.4 21.27,21.91 v20.64,22.54
  other vias: 4.45,1.91 12.06,1.91 43.81,8.26 19.68,5.4 10.48,10.79 11.43,30.8 12.7,30.8 11.43,29.21 12.7,24.77 12.7,22.86 4.76,16.83 15.88,14.29 19.37,0.95 4.45,22.23 41.27,22.23 4.45,29.84 41.27,29.84 8.26,26.04 37.47,26.04 26.04,8.57 26.35,11.11
  pour Route2 (isolate 0.254): 0.64,31.11 45.09,31.11 45.09,0.64 0.64,0.64
  pour Top (isolate 0.254): 0.64,31.11 0.64,0.64 45.09,0.64 45.09,31.11
  pour Bottom (isolate 0.254, rank 2): 0.64,31.11 0.64,0.64 45.09,0.64 45.09,31.11
  pour Top (isolate 0.203): 26.67,19.68 36.83,19.68 36.83,9.53 26.67,9.53
LX
  Top 0.61: L5.1 5.71,11.31 U16.6 7.07,15.43 C15.2 8.36,15.98 9.23,16.85 D2.C
MISO  (via drill 0.3)
  Top 0.254: U4.21 31.41,15.86 v30.48,14.92
  Bottom 0.254: JP5.6 33.66,4.45 32.7,5.4 31.11,5.4 28.89,7.62 28.89,13.34 v30.48,14.92
MOSI  (via drill 0.3)
  Top 0.254: U4.19 32.32,14.86 v31.11,13.65
  Bottom 0.254: JP5.8 38.73,3.49 38.1,4.13 35.56,6.67 31.75,6.67 30.16,8.26 30.16,12.7 v31.11,13.65
N$1
  Top 0.254: R2.2 D5.A
N$2
  Top 0.254: R7.2 D4.A
N$3
  Top 0.254: D1.A R3.2
N$4
  Top 0.305: J1.1 32.41,26.82 33.02,26.21 F1.1
N$5
  Top 0.254: C2.1 25.79,9.53 X2.P$1 26.11,9.46 26.99,8.89 28.26,8.89 29,9.63 U4.1
N$7
  Top 0.254: C4.1 25.79,7.62 X2.P$2 26.92,8.26 28.26,8.26 29.5,9.5 U4.2
N$8
  Top 0.305: U16.1 7.07,18.23 C15.1
N$9
  Top 0.305: R6.1 13.34,7.77 13.34,7.79 13.28,7.85 U2.4
N$11
  Top 0.305: R5.1 R1.2 3.81,20.46 U16.3
RXD  (via drill 0.3)
  Top 0.254: U4.38 26.01,16.86 25.4,17.46 v25.08,17.46
  Bottom 0.254: v25.08,17.46 23.5,15.88 23.5,15.56 JP5.2
SCL  (via drill 0.3)
  Top 0.254: U4.32 31,20.52 v31.11,20.64
  Bottom 0.254: v31.11,20.64 30.16,20.64 26.99,17.46 24.77,15.24 24.77,4.45 26.04,3.17 JP5.3
SCLK  (via drill 0.3)
  Top 0.254: U4.20 31.86,15.36 v30.8,14.29
  Bottom 0.254: v30.8,14.29 30.16,13.65 29.53,13.02 29.53,7.94 31.43,6.03 33.66,6.03 36.2,3.49 JP5.7
SDA  (via drill 0.3)
  Top 0.254: U4.31 31.5,20.07 31.75,20.32 v31.75,21.27
  Bottom 0.254: JP5.4 25.4,5.08 25.4,12.7 27.62,14.92 27.62,15.88 31.75,20 v31.75,21.27
SWDCLK
  Top 0.254: TC1.5 20.32,14.29 20.95,13.65 20.95,12.7 21.59,12.06 25.08,12.06 26.37,13.36 U4.45
SWDIO
  Top 0.254: TC1.4 16.83,13.02 16.19,12.38 16.19,10.48 17.46,9.21 19.37,9.21 21.59,11.43 25.08,11.43 26.51,12.86 U4.46
TXD  (via drill 0.3)
  Top 0.254: U4.37 26.46,17.36 25.72,18.1 v25.4,18.1
  Bottom 0.254: v25.4,18.1 24.77,18.1 22.86,16.19 22.86,4.76 20.95,2.86 JP5.1
USB-SHIELD  (via drill 0.3)
  other vias: 27.3,30.48 29.84,30.48 32.38,30.48 34.92,30.48 34.29,27.94 27.94,27.94
  pour Bottom: 26.35,31.11 26.35,26.99 35.88,26.99 35.88,31.11
VBUS  (via drill 0.3)
  Top 0.305: U2.6 11.44,12.71 12.06,13.34 v12.7,13.34 | F1.2 33.83,23.95 34.6,23.18 C18.1 v35.56,21.91
  Route15 0.61: v12.7,13.34 16.51,17.14 19.68,17.14 21.91,19.37 21.91,25.72 23.18,26.99 29.84,26.99 31.43,26.99 35.56,22.86 v35.56,21.91
VDDCORE
  Top 0.254: C1.1 25.08,15.24 25.97,14.36 U4.43
VIN  (via drill 0.41)
  Top 0.61: U16.5 4.76,14.61 v4.45,14.29 v3.49,14.29 3.81,14.61 U16.4
  Top 0.813: D3.C v17.78,18.41 v16.83,18.41 C6.1
  Route15 0.813: v17.78,18.41 v16.83,18.41 13.34,18.41 8.57,18.41 v4.45,14.29 v3.49,14.29 3.49,12.38 0.95,9.84 0.95,2.86 H1.1
  other vias: 1.91,1.91
VIN_PRE  (via drill 0.41)
  Top 0.254: J2.1B 24.13,29.28 v24.13,29.21 | J2.1B 22.86,29.28 v22.86,29.21 | J2.1B 22.86,30.55 v22.86,30.8 | J2.1B 23.5,30.16 v24.13,30.8 | J2.1A 23.47,23.79 | J2.1A 23.5,23.5 v22.86,22.86 | J2.1A 23.5,24.13 v22.86,24.77
  Top 0.813: J2.1B J2.1A | 23.47,23.79 D3.A

### Text on the board
tPlace: A2 | A1 | A0 | GND | 7 | 6 | 5 | 2 | 8 | 9 | 4 | 3 | 1 | 0
bPlace: A5 | GAMETROLLER | FEATHER M0 | A4 | ATSAMD21G18 | 3.3V 48MHz | A3 | GND | 3V3 | VIN | GND | 5V | 3V3 | GND | TXD | RXD | SCL | SDA | GND | MISO | SCLK | MOSI | 10 | 11